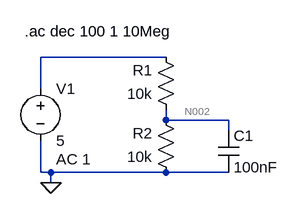
[diagram p0: schematic RCFilterSimulation.asc]
RCFilterSimulation.asc, the LTspice schematic file:
Version 4.1
SHEET 1 880 680
WIRE 192 48 0 48
WIRE 0 96 0 48
WIRE 192 144 192 128
WIRE 288 144 192 144
WIRE 288 160 288 144
WIRE 0 224 0 176
WIRE 16 224 0 224
WIRE 192 224 16 224
WIRE 288 224 192 224
WIRE 16 240 16 224
FLAG 16 240 0
SYMBOL res 208 144 R180
WINDOW 0 36 76 Left 2
WINDOW 3 36 40 Left 2
SYMATTR InstName R1
SYMATTR Value 10k
SYMBOL res 208 240 R180
WINDOW 0 36 76 Left 2
WINDOW 3 36 40 Left 2
SYMATTR InstName R2
SYMATTR Value 10k
SYMBOL cap 272 160 R0
SYMATTR InstName C1
SYMATTR Value 100nF
SYMBOL voltage 0 80 R0
WINDOW 123 24 124 Left 2
WINDOW 39 0 0 Left 0
SYMATTR InstName V1
SYMATTR Value 5
SYMATTR Value2 AC 1
TEXT -24 8 Left 2 !.ac dec 100 1 10Meg

The netlist it stands for:
* RCFilterSimulation.asc
R1 N002 N001 10k
R2 0 N002 10k
C1 N002 0 100nF
V1 N001 0 5 AC 1
.ac dec 100 1 10Meg
.backanno
.end

* Results of the author's LTspice run, read from the files saved beside the schematic
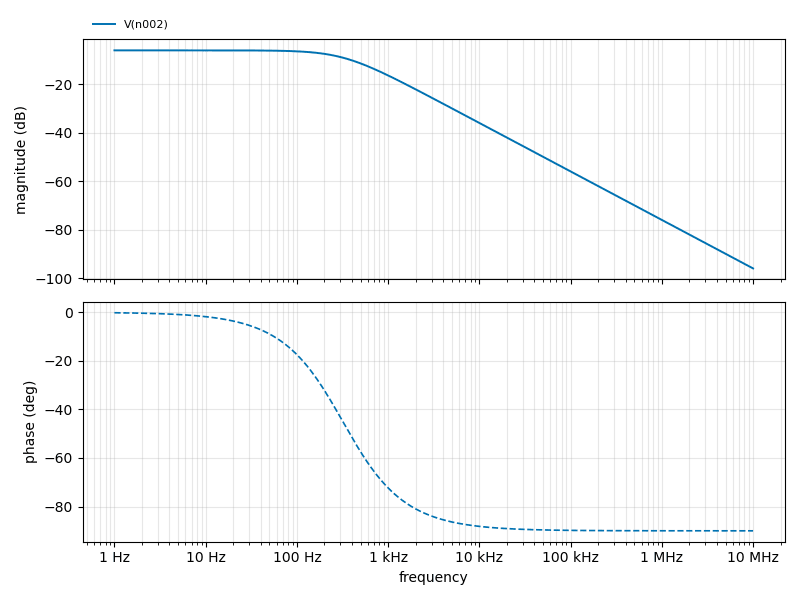
[diagram p1: AC Analysis of RCFilterSimulation.asc, plotted from the saved traces]
* AC Analysis, 1 run:
*   V(n002): -6.02 dB at 1 Hz, -95.96 dB at 10 MHz, peak -6.02 dB at 1 Hz, 3 dB below the peak at 318.3 Hz